# EAGLE design RFID_Eval_13.56MHz (EAGLE 5.11)
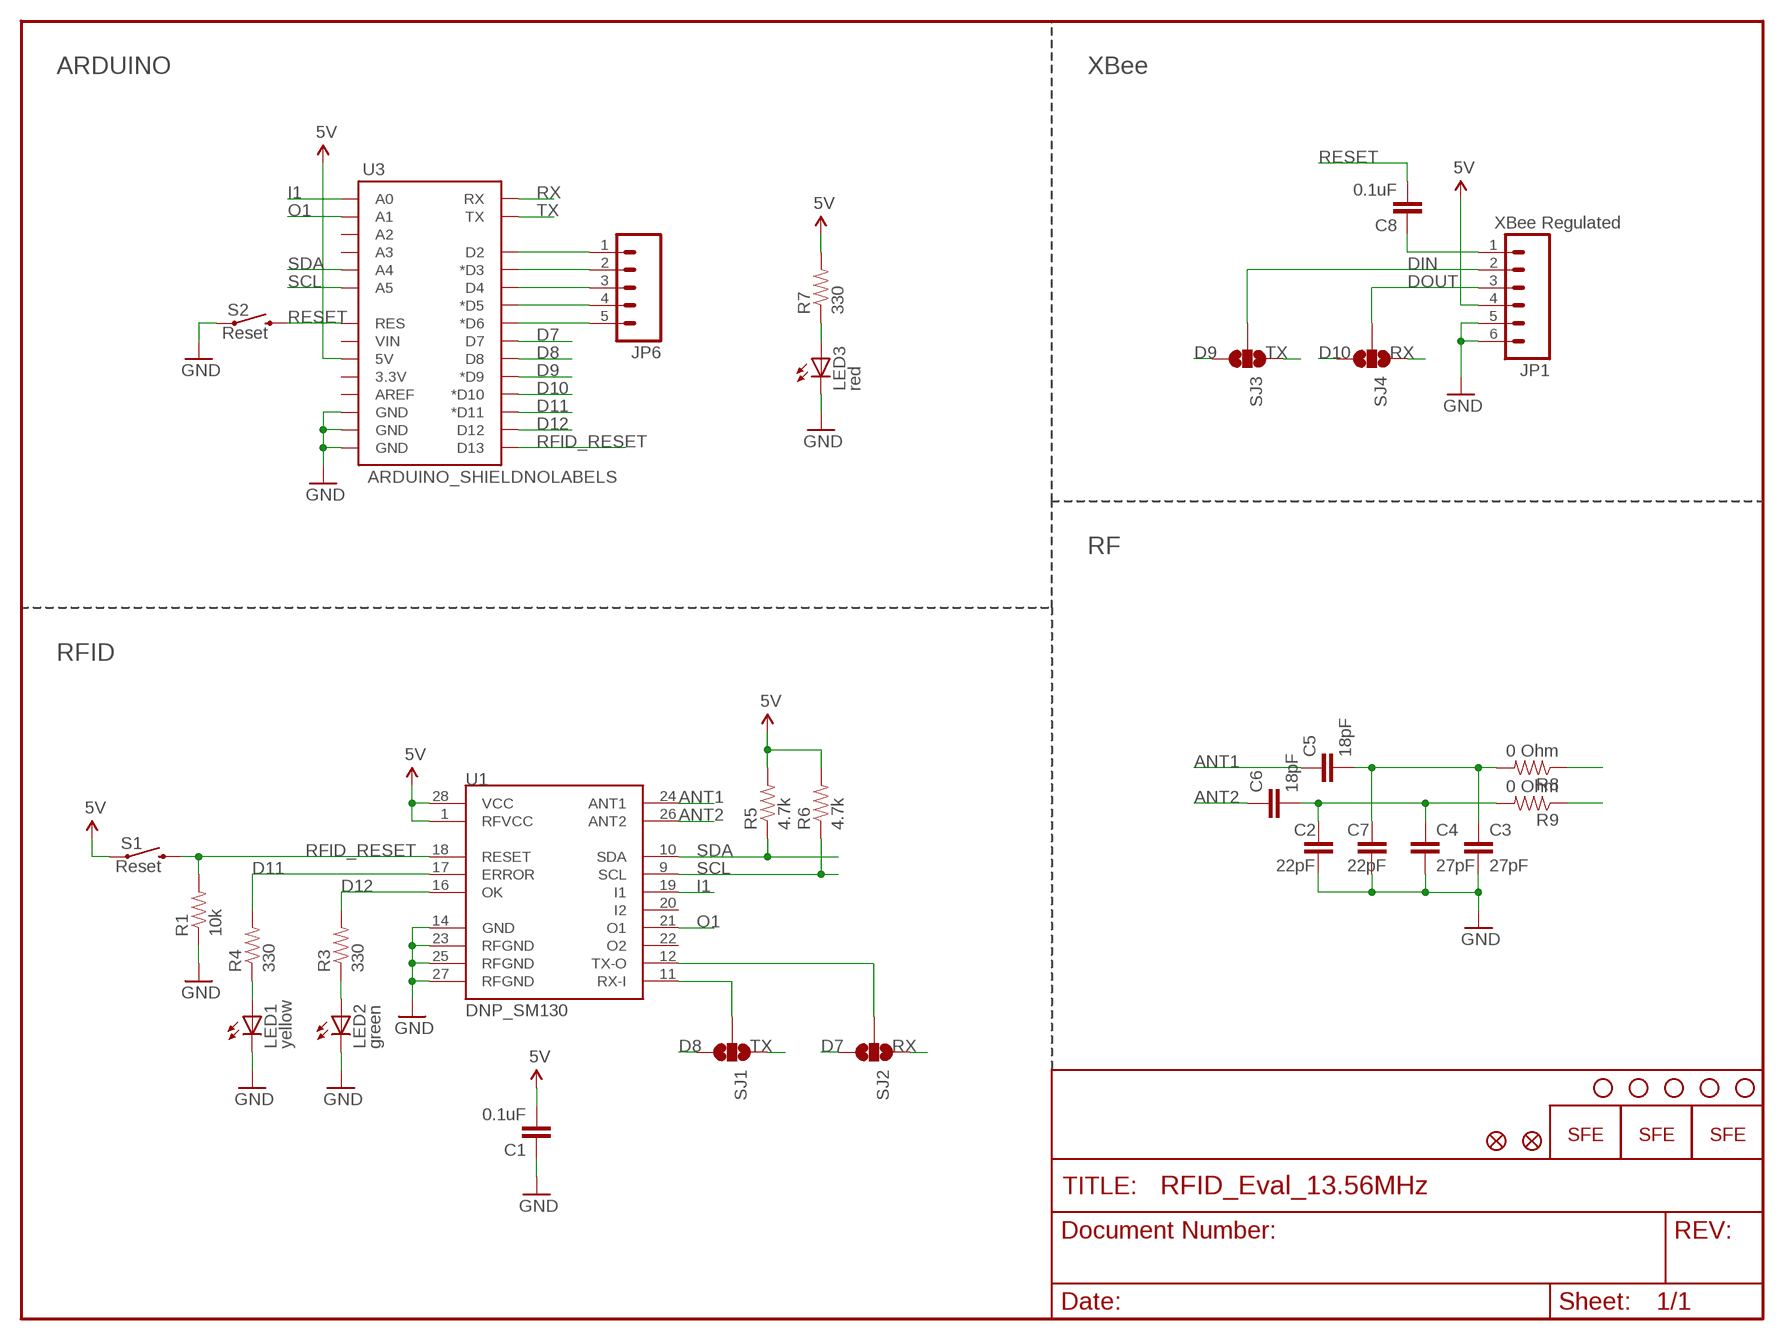
[diagram p0: schematic, sheet 1]

## Parts
C1  0.1uF  CAP0402-CAP  [0402-CAP]
C2  22pF  CAP0402-CAP  [0402-CAP]
C3  27pF  CAP0402-CAP  [0402-CAP]
C4  27pF  CAP0402-CAP  [0402-CAP]
C5  18pF  CAP0402-CAP  [0402-CAP]
C6  18pF  CAP0402-CAP  [0402-CAP]
C7  22pF  CAP0402-CAP  [0402-CAP]
C8  0.1uF  CAP0402-CAP  [0402-CAP]
JP1  XBee Regulated  M06SIP  [1X06]
JP2  LOGO-SFENEW  [SFE-NEW-WEBLOGO]
JP3  STAND-OFF  [STAND-OFF]
JP4  LOGO-SFESK  [SFE-LOGO-FLAME]
JP5  STAND-OFF  [STAND-OFF]
JP6  M05PTH  [1X05]
JP7  STAND-OFF  [STAND-OFF]
JP8  LOGO-SFENEW  [SFE-NEW-WEBLOGO]
JP10  STAND-OFF  [STAND-OFF]
JP11  FIDUCIAL1X2  [FIDUCIAL-1X2]
JP12  FIDUCIAL1X2  [FIDUCIAL-1X2]
JP13  STAND-OFF  [STAND-OFF]
LED1  yellow  LED0603  [LED-0603]
LED2  green  LED0603  [LED-0603]
LED3  red  LED0603  [LED-0603]
R1  10k  RESISTOR0402-RES  [0402-RES]
R3  330  RESISTOR0402-RES  [0402-RES]
R4  330  RESISTOR0402-RES  [0402-RES]
R5  4.7k  RESISTOR0402-RES  [0402-RES]
R6  4.7k  RESISTOR0402-RES  [0402-RES]
R7  330  RESISTOR0402-RES  [0402-RES]
R8  0 Ohm  RESISTOR0402-RES  [0402-RES]
R9  0 Ohm  RESISTOR0402-RES  [0402-RES]
S1  Reset  SWITCH-MOMENTARY-2SMD  [TACTILE_SWITCH_SMD]
S2  Reset  SWITCH-MOMENTARY-2SMD  [TACTILE_SWITCH_SMD]
SJ1  SOLDERJUMPER_2WAYPASTE2&3  [SJ_3_PASTE2&3]
SJ2  SOLDERJUMPER_2WAYPASTE2&3  [SJ_3_PASTE2&3]
SJ3  SOLDERJUMPER_2WAYPASTE2&3  [SJ_3_PASTE2&3]
SJ4  SOLDERJUMPER_2WAYPASTE2&3  [SJ_3_PASTE2&3]
U1  DNP_SM130  SM130  [SM130]
U3  ARDUINO_SHIELDNOLABELS  [DUEMILANOVE_SHIELD_NOLABELS]

## Nets
5V: C1.2 JP1.4 R5.2 R6.2 R7.2 S1.1 U1.1(RFVCC) U1.28(VCC) U3.5V
ANT1: C5.1 U1.24(ANT1)
ANT2: C6.1 U1.26(ANT2)
D7: SJ2.3 U3.D7
D8: SJ1.3 U3.D8
D9: SJ3.3 U3.D9(*D9)
D10: SJ4.3 U3.D10(*D10)
D11: R4.2 U1.17(ERROR) U3.D11(*D11)
D12: R3.2 U1.16(OK) U3.D12
DIN: JP1.2 SJ3.2
DOUT: JP1.3 SJ4.2
GND: C1.1 C2.2 C3.2 C4.2 C7.2 JP1.5 JP1.6 LED1.C LED2.C LED3.C R1.1 S2.1 U1.14(GND) U1.23(RFGND) U1.25(RFGND) U1.27(RFGND) U3.GND@0(GND) U3.GND@1(GND) U3.GND@2(GND)
I1: U1.19(I1) U3.A0
N$1: LED1.A R4.1
N$2: LED2.A R3.1
N$7: LED3.A R7.1
N$8: R8.1
N$9: R9.1
N$10: C3.1 C5.2 C7.1 R8.2
N$11: C2.1 C4.1 C6.2 R9.2
N$15: SJ2.2 U1.12(TX-O)
N$16: SJ1.2 U1.11(RX-I)
N$61: C8.1 JP1.1
N$62: JP6.1 U3.D2
N$63: JP6.2 U3.D3(*D3)
N$64: JP6.3 U3.D4
N$65: JP6.4 U3.D5(*D5)
N$66: JP6.5 U3.D6(*D6)
O1: U1.21(O1) U3.A1
RESET: C8.2 S2.3 U3.RES
RFID_RESET: R1.2 S1.3 U1.18(RESET) U3.D13
RX: SJ2.1 SJ4.1 U3.RX
SCL: R6.1 U1.9(SCL) U3.A5
SDA: R5.1 U1.10(SDA) U3.A4
TX: SJ1.1 SJ3.1 U3.TX
Unconnected: U1.20(I2) U1.22(O2) U3.3.3V U3.A2 U3.A3 U3.AREF U3.VIN

## Notes on the sheet
- ARDUINO | XBee
- RF
- RFID

## Library data of the parts
C1-C8 = SparkFun:CAP: Capacitor Standard 0603 ceramic capacitor, and 0.1" leaded capacitor.
JP1 = SparkFun:M06: Header 6 Standard 6-pin 0.1" header. Use with straight break away headers (SKU : PRT-00116), right angle break away headers (PRT-00553), swiss pins (PRT-00743), machine pins (PRT-00117), and female headers (PRT-00115). Molex polarized connector foot print use with SKU : PRT-08094 with associated crimp pins and housings. NOTES ON THE VARIANTS LOCK and LOCK_LONGPADS... This footprint was designed to help hold the alignment of a through-hole component (i.e. 6-pin header) while soldering it into place. You may notice that each hole has been shifted either up or down by 0.005 of an inch from it's more standard position (which is a perfectly straight line). This slight alteration caused the pins (the squares in the middle) to touch the edges of the holes. Because they are alternating, it causes a "brace" to hold the component in place. 0.005 has proven to be the perfect amount of "off-center" position when using our standard breakaway headers. Although looks a little odd when you look at the bare footprint, once you have a header in there, the alteration is very hard to notice. Also, if you push a header all the way into place, it is covered up entirely on the bottom side. This idea of altering the position of holes to aid alignment will be further integrated into the Sparkfun Library for other footprints. It can help hold any component with 3 or more connection pins.
JP2 JP4 JP8 = SparkFun:LOGO-SFE: Spark Fun Electronics PCB Logo This is the standard Spark Fun Electronics PCB logo.
JP3 JP5 JP7 JP10 JP13 = SparkFun:STAND-OFF: Stand Off This is the mechanical footprint for a #4 phillips button head screw. Use the keepout ring to avoid running the screw head into surrounding components. SKU : PRT-00447
JP6 = SparkFun:M05: Header 5 Standard 5-pin 0.1" header. Use with straight break away headers (SKU : PRT-00116), right angle break away headers (PRT-00553), swiss pins (PRT-00743), machine pins (PRT-00117), and female headers (PRT-00115). Molex polarized connector foot print use with SKU : PRT-08230 with associated crimp pins and housings.
JP11 JP12 = SparkFun:FIDUCIAL: Fiducial Alignment Points Various fiducial points for machine vision alignment.
LED1-LED3 = SparkFun:LED: LEDs Standard schematic elements and footprints for 5mm, 3mm, 1206, and 0603 sized LEDs. 5mm - Spark Fun Electronics SKU : COM-00529 (and others)
R1 R3-R9 = SparkFun:RESISTOR: Resistor Basic schematic elements and footprints for 0603, 1206, and PTH resistors.
S1 S2 = SparkFun:SWITCH-MOMENTARY-2
SJ1-SJ4 = SparkFun:SOLDERJUMPER_2WAY: Solder Jumper 2 way solder jumper
U1 = SparkFun:SM130: 13.56MHz RFID Mifare Read/Write Module
U3 = SparkFun:ARDUINO_SHIELD

## Board
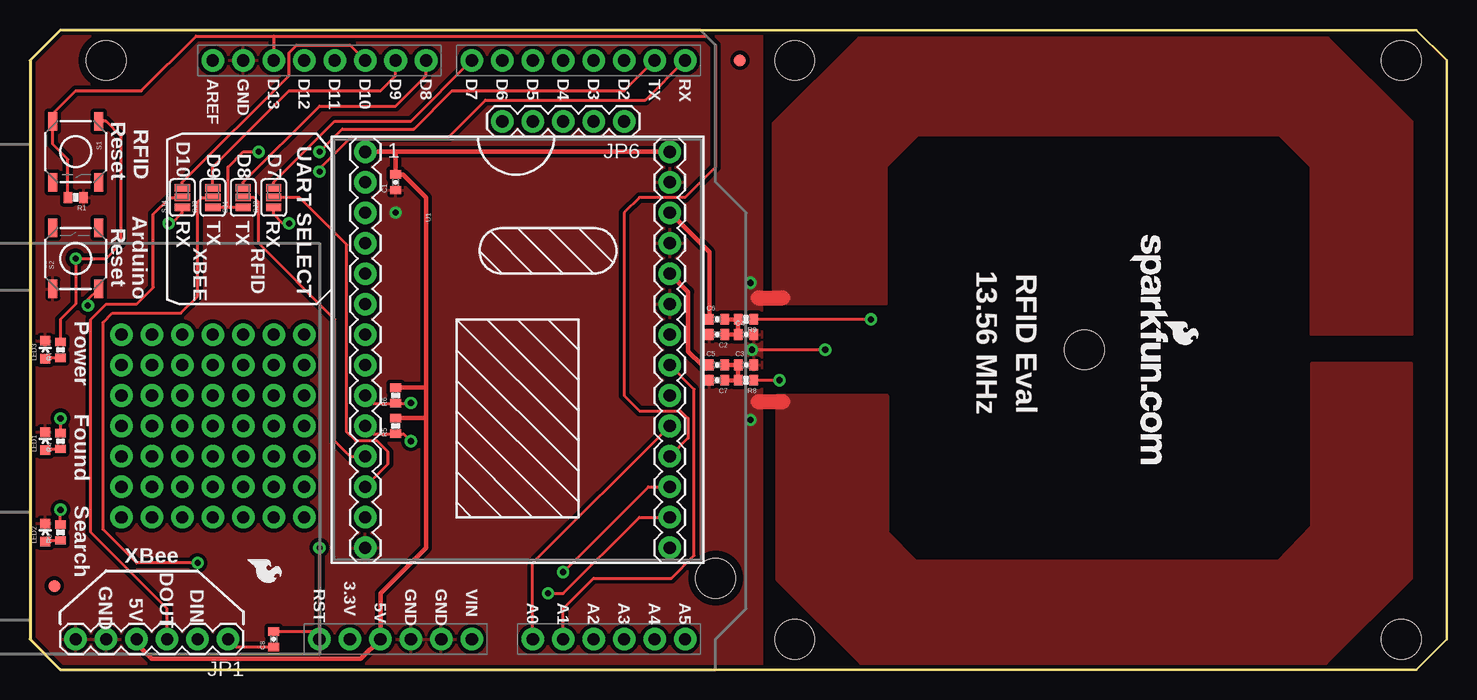
[diagram p1: board, top side]
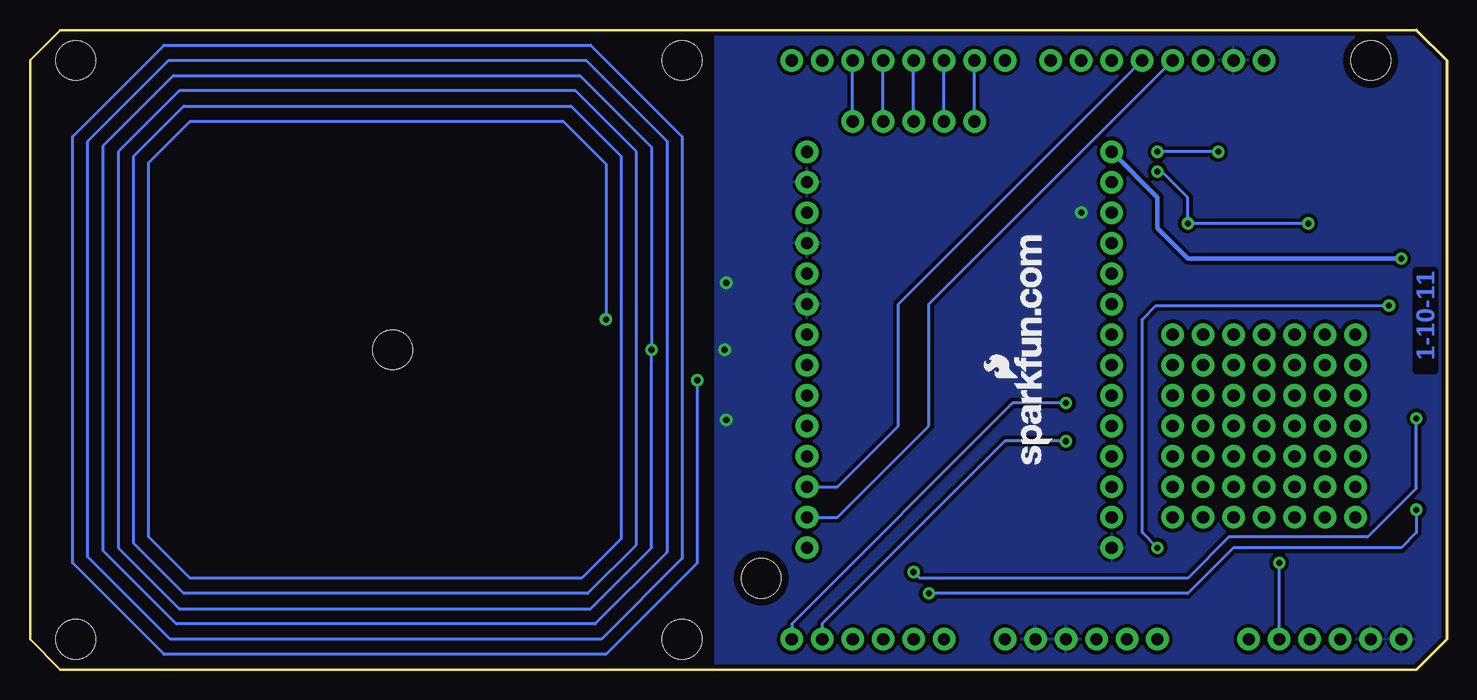
[diagram p2: board, bottom side, seen from below]

Size 118.11 x 53.34 mm. Coordinates in mm from the lower left corner, seen from the top.
Outline: 0,50.8 0,2.54 2.54,0 115.57,0 118.11,2.54 118.11,50.8 115.57,53.34 2.54,53.34 0,50.8
Copper layers (1*16): Top 0.035mm / dielectric 1.5mm / Bottom 0.035mm
Design rules "SparkFun": minimum track width 8mil, minimum drill 20mil, track to track 8mil, track to pad 8mil, pad to pad 8mil, via to via 8mil, smd to smd 8mil, copper to edge 8mil, drill to drill 8mil, minimum pad ring 12mil, minimum via ring 10mil, stop-mask expansion 4mil, vias tented up to drill 20mil, thermal gap 10mil

### Footprints (pad centres in the part's own frame; a part is rotated, then mirrored left to right if it is on the bottom)
0402-CAP = smd 0.7 x 0.9: 1 -0.65,0; 2 0.65,0
1X06 = drill 1.016 pad 1.88 round: 1 0,0; 2 2.54,0; 3 5.08,0; 4 7.62,0; 5 10.16,0; 6 12.7,0
STAND-OFF = hole 3.302: 0,0
1X05 = drill 1.016 pad 1.88 round: 1 0,0; 2 2.54,0; 3 5.08,0; 4 7.62,0; 5 10.16,0
FIDUCIAL-1X2 = smd 1 x 1: 1 0,0
LED-0603 = smd 0.8 x 0.8: A 0,-0.75; C 0,0.75
0402-RES = smd 0.7 x 0.9: 1 -0.65,0; 2 0.65,0
TACTILE_SWITCH_SMD = smd 1.524 x 0.762: 1 -2.54,1.905; 2 2.54,1.905; 3 -2.54,-1.905; 4 2.54,-1.905
SJ_3_PASTE2&3 = smd 0.635 x 1.27: 1 -0.813,0; 2 0,0; 3 0.813,0
SM130 = drill 1.016 pad 1.88 round: 1 -17.78,-12.7; 2 -15.24,-12.7; 3 -12.7,-12.7; 4 -10.16,-12.7; 5 -7.62,-12.7; 6 -5.08,-12.7; 7 -2.54,-12.7; 8 0,-12.7; 9 2.54,-12.7; 10 5.08,-12.7; 11 7.62,-12.7; 12 10.16,-12.7; 13 12.7,-12.7; 14 15.24,-12.7; 15 15.24,12.7; 16 12.7,12.7; 17 10.16,12.7; 18 7.62,12.7; 19 5.08,12.7; 20 2.54,12.7; 21 0,12.7; 22 -2.54,12.7; 23 -5.08,12.7; 24 -7.62,12.7; 25 -10.16,12.7; 26 -12.7,12.7; 27 -15.24,12.7; 28 -17.78,12.7
DUEMILANOVE_SHIELD_NOLABELS = drill 1.016 pad 1.88 round: 3.3V 50.8,26.67; 5V 50.8,29.21; A0 50.8,41.91; A1 50.8,44.45; A2 50.8,46.99; A3 50.8,49.53; A4 50.8,52.07; A5 50.8,54.61; AREF 2.54,15.24; D2 2.54,49.53; D3 2.54,46.99; D4 2.54,44.45; D5 2.54,41.91; D6 2.54,39.37; D7 2.54,36.83; D8 2.54,33.02; D9 2.54,30.48; D10 2.54,27.94; D11 2.54,25.4; D12 2.54,22.86; D13 2.54,20.32; GND@0 50.8,31.75; GND@1 50.8,34.29; GND@2 2.54,17.78; RES 50.8,24.13; RX 2.54,54.61; TX 2.54,52.07; VIN 50.8,36.83 | hole 3.302: 45.72,57.15; 2.54,6.35

### Placement (x,y rotation side)
C1  30.48,40.64 90 top
C2  57.28,27.94 180 top
C3  59.69,25.4 0 top
C4  59.69,27.94 0 top
C5  57.28,25.4 0 top
C6  57.28,29.21 0 top
C7  57.28,24.13 180 top
C8  20.32,2.54 90 top
JP1  16.51,2.54 180 top
JP2  32.89,17.14 90 bottom
JP3  87.88,26.67 0 top
JP4  18.16,9.14 270 top
JP5  114.3,50.8 0 top
JP6  49.53,45.72 180 top
JP7  114.3,2.54 0 top
JP8  91.69,36.2 270 top
JP10  63.75,50.8 0 top
JP11  2.03,6.99 0 top
JP12  59.18,50.8 0 top
JP13  63.75,2.54 0 top
LED1  1.27,19.05 0 top
LED2  1.27,11.43 0 top
LED3  1.27,26.67 0 top
R1  3.81,39.37 180 top
R3  2.54,11.43 90 top
R4  2.54,19.05 90 top
R5  30.48,20.32 90 top
R6  30.48,22.86 90 top
R7  2.54,26.67 90 top
R8  59.69,24.13 180 top
R9  59.69,29.21 180 top
S1  3.81,43.18 270 top
S2  3.81,34.29 90 top
SJ1  17.78,39.37 90 top
SJ2  20.32,39.37 90 top
SJ3  15.24,39.37 90 top
SJ4  12.7,39.37 90 top
U1  40.64,25.4 270 top
U3  0,53.34 270 top

### Tracks (layer width: path | path; a pad name or v marks a point on that pad's centre or on a via)
5V  (via drill 0.51)
  Top 0.254: S1.1 6.35,45.72 7.62,44.45 7.62,35.56 6.35,34.29 v3.81,34.29 3.81,30.48 2.54,29.21 R7.2
  Top 0.356: JP1.4 8.89,2.16 10.16,0.89 27.56,0.89 U3.5V 29.21,6.35 33.02,10.16 33.02,20.95 | 30.48,43.18 U1.1 | 30.48,43.18 U1.28 | 30.48,43.18 C1.2 31.1,41.29 33.02,39.37 33.02,23.5 | 33.02,20.95 33.02,23.5 | R5.2 33.01,20.97 33.02,20.95 | R6.2 33.01,23.51 33.02,23.5
  Bottom 0.381: v3.81,34.29 21.59,34.29 24.13,36.83 24.13,39.37 U1.1
ANT1
  Top 0.381: U1.24 54.86,31.5 54.86,26.54 56.01,25.4 C5.1
ANT2
  Top 0.381: C6.1 56.63,34.81 U1.26
D7
  Top 0.254: SJ2.3 20.32,40.64 25.4,45.72 31.75,45.72 U3.D7
D8
  Top 0.254: U3.D8 33.02,49.53 30.48,46.99 24.13,46.99 17.78,40.64 SJ1.3
D9
  Top 0.254: U3.D9 30.48,49.53 29.21,48.26 21.59,48.26 15.24,41.91 SJ3.3
D10
  Top 0.254: SJ4.3 12.7,40.64 21.59,49.53 21.59,51.44 22.23,52.07 26.67,52.07 U3.D10
D11  (via drill 0.51)
  Top 0.254: v2.54,20.95 R4.2 | U1.17 51.56,15.24 v44.45,8.13
  Bottom 0.254: U3.D11 45.72,30.48 45.72,20.32 50.8,15.24 U1.17 | v2.54,20.95 2.54,15.11 6.6,11.05 18.16,11.05 21.59,7.62 43.94,7.62 v44.45,8.13
D12  (via drill 0.51)
  Top 0.254: R3.2 v2.54,13.34 | v43.18,6.35 44.45,6.35 50.8,12.7 U1.16
  Bottom 0.254: U3.D12 43.18,30.48 43.18,20.32 50.8,12.7 U1.16 | v2.54,13.34 2.54,11.43 3.81,10.16 17.78,10.16 21.59,6.35 v43.18,6.35
DIN  (via drill 0.51)
  Top 0.254: SJ3.2 14.35,39.37 13.97,38.99 13.97,31.11 12.57,29.72 6.86,29.72 6.1,28.96 6.1,11.68 8.89,8.89 v13.97,8.89
  Bottom 0.254: JP1.2 v13.97,8.89
DOUT
  Top 0.254: SJ4.2 11.68,39.37 10.29,37.97 10.29,31.88 8.89,30.48 6.35,30.48 5.08,29.21 5.08,11.43 11.43,5.08 JP1.3
GND  (via drill 0.51)
  Top 0.254: v66.29,26.67 v60.2,26.67 59.69,26.67 | v70.1,29.21 60.33,29.21
  Top 0.813: 60.71,22.35 60.58,22.23
  Top 1.27: 60.71,22.35 62.74,22.35 | 60.71,30.99 62.74,30.99
  Bottom 0.254: v66.29,26.67 66.29,10.16 71.37,5.08 105.66,5.08 110.74,10.16 110.74,43.18 105.66,48.26 72.64,48.26 67.56,43.18 67.56,10.41 71.63,6.35 105.28,6.35 109.47,10.54 109.47,42.8 105.28,46.99 73.03,46.99 68.83,42.8 68.83,10.92 72.14,7.62 104.78,7.62 108.2,11.05 108.2,42.29 104.78,45.72 73.66,45.72 70.1,42.16 v70.1,29.21
  other vias: 60.07,32.26 60.07,20.83 30.48,38.1
  pour Bottom (isolate 0.305): 0,53.34 60.96,53.34 60.96,0 0,0
  pour Top (isolate 0.305): 0,53.34 60.96,53.34 60.96,0 0,0
  pour Top (isolate 0.305): 61.98,30.48 61.98,45.59 69.09,52.7 108.2,52.7 115.19,45.72 115.19,27.94 106.81,27.94 106.81,41.91 104.14,44.58 74.04,44.58 71.37,41.91 71.37,30.48
  pour Top (isolate 0.305): 106.81,25.53 106.81,11.94 104.01,9.02 73.91,9.02 71.5,11.43 71.5,22.86 62.23,22.86 62.23,7.49 69.22,0.51 108.08,0.51 115.19,7.62 115.19,25.53
I1
  Top 0.254: U3.A0 41.91,8.89 U1.19
N$1
  Top 0.254: R4.1 1.37,18.4 LED1.A
N$2
  Top 0.254: R3.1 1.37,10.78 LED2.A
N$3  (via drill 1.02 pad 1.88)
  other vias: 7.62,27.94
N$4  (via drill 1.02 pad 1.88)
  other vias: 7.62,25.4
N$5  (via drill 1.02 pad 1.88)
  other vias: 7.62,22.86
N$6  (via drill 1.02 pad 1.88)
  other vias: 7.62,20.32
N$7
  Top 0.254: R7.1 1.37,26.02 LED3.A
N$8  (via drill 0.51)
  Top 0.254: v62.48,24.13 R8.1
  Bottom 0.254: v62.48,24.13 62.48,8.89 70.1,1.27 106.93,1.27 114.55,8.89 114.55,44.45 106.93,52.07 71.37,52.07 63.75,44.45 63.75,9.27 70.48,2.54 106.43,2.54 113.28,9.4 113.28,44.07 106.55,50.8 71.75,50.8 65.02,44.07 65.02,9.78 70.99,3.81 105.92,3.81 112.01,9.91 112.01,43.69 106.17,49.53 72.26,49.53 66.29,43.56 66.29,26.67
N$10
  Top 0.381: C5.2 C3.1 R8.2 C7.1
N$11
  Top 0.381: C6.2 R9.2 C4.1 C2.1
N$12  (via drill 1.02 pad 1.88)
  other vias: 7.62,17.78
N$15
  Top 0.254: SJ2.2 22.48,39.37 26.42,35.43 26.42,19.81 27.18,19.05 28.96,19.05 29.84,18.16 29.84,17.14 U1.12
N$16
  Top 0.254: SJ1.2 18.67,39.37 19.05,38.99 19.05,35.56 25.4,29.21 25.4,19.05 26.67,17.78 U1.11
N$17  (via drill 1.02 pad 1.88)
  other vias: 7.62,15.24
N$18  (via drill 1.02 pad 1.88)
  other vias: 7.62,12.7
N$19  (via drill 1.02 pad 1.88)
  other vias: 10.16,12.7
N$20  (via drill 1.02 pad 1.88)
  other vias: 10.16,15.24
N$21  (via drill 1.02 pad 1.88)
  other vias: 10.16,17.78
N$22  (via drill 1.02 pad 1.88)
  other vias: 10.16,20.32
N$23  (via drill 1.02 pad 1.88)
  other vias: 10.16,22.86
N$24  (via drill 1.02 pad 1.88)
  other vias: 10.16,25.4
N$25  (via drill 1.02 pad 1.88)
  other vias: 10.16,27.94
N$26  (via drill 1.02 pad 1.88)
  other vias: 12.7,27.94
N$27  (via drill 1.02 pad 1.88)
  other vias: 12.7,25.4
N$28  (via drill 1.02 pad 1.88)
  other vias: 12.7,22.86
N$29  (via drill 1.02 pad 1.88)
  other vias: 12.7,20.32
N$30  (via drill 1.02 pad 1.88)
  other vias: 12.7,17.78
N$31  (via drill 1.02 pad 1.88)
  other vias: 12.7,15.24
N$32  (via drill 1.02 pad 1.88)
  other vias: 12.7,12.7
N$33  (via drill 1.02 pad 1.88)
  other vias: 15.24,12.7
N$34  (via drill 1.02 pad 1.88)
  other vias: 15.24,15.24
N$35  (via drill 1.02 pad 1.88)
  other vias: 15.24,17.78
N$36  (via drill 1.02 pad 1.88)
  other vias: 15.24,20.32
N$37  (via drill 1.02 pad 1.88)
  other vias: 15.24,22.86
N$38  (via drill 1.02 pad 1.88)
  other vias: 15.24,25.4
N$39  (via drill 1.02 pad 1.88)
  other vias: 15.24,27.94
N$40  (via drill 1.02 pad 1.88)
  other vias: 17.78,27.94
N$41  (via drill 1.02 pad 1.88)
  other vias: 17.78,25.4
N$42  (via drill 1.02 pad 1.88)
  other vias: 17.78,22.86
N$43  (via drill 1.02 pad 1.88)
  other vias: 17.78,20.32
N$44  (via drill 1.02 pad 1.88)
  other vias: 17.78,17.78
N$45  (via drill 1.02 pad 1.88)
  other vias: 17.78,15.24
N$46  (via drill 1.02 pad 1.88)
  other vias: 17.78,12.7
N$47  (via drill 1.02 pad 1.88)
  other vias: 20.32,12.7
N$48  (via drill 1.02 pad 1.88)
  other vias: 20.32,15.24
N$49  (via drill 1.02 pad 1.88)
  other vias: 20.32,17.78
N$50  (via drill 1.02 pad 1.88)
  other vias: 20.32,20.32
N$51  (via drill 1.02 pad 1.88)
  other vias: 20.32,22.86
N$52  (via drill 1.02 pad 1.88)
  other vias: 20.32,25.4
N$53  (via drill 1.02 pad 1.88)
  other vias: 20.32,27.94
N$54  (via drill 1.02 pad 1.88)
  other vias: 22.86,27.94
N$55  (via drill 1.02 pad 1.88)
  other vias: 22.86,25.4
N$56  (via drill 1.02 pad 1.88)
  other vias: 22.86,22.86
N$57  (via drill 1.02 pad 1.88)
  other vias: 22.86,20.32
N$58  (via drill 1.02 pad 1.88)
  other vias: 22.86,17.78
N$59  (via drill 1.02 pad 1.88)
  other vias: 22.86,15.24
N$60  (via drill 1.02 pad 1.88)
  other vias: 22.86,12.7
N$61
  Top 0.254: C8.1 17.16,1.89 JP1.1
N$62
  Bottom 0.254: JP6.1 U3.D2
N$63
  Bottom 0.254: JP6.2 U3.D3
N$64
  Bottom 0.254: JP6.3 U3.D4
N$65
  Bottom 0.254: JP6.4 U3.D5
N$66
  Bottom 0.254: JP6.5 U3.D6
O1
  Top 0.254: U3.A1 44.45,5.08 46.99,7.62 53.47,7.62 55.37,9.53 55.37,23.37 U1.21
RESET  (via drill 0.51)
  Top 0.254: C8.2 23.48,3.19 U3.RES v24.13,10.16 | v4.83,30.35 4.83,30.86 S2.3
  Bottom 0.254: v24.13,10.16 25.4,11.43 25.4,29.21 24.26,30.35 v4.83,30.35
RFID_RESET
  Top 0.254: R1.2 3.16,42.56 1.91,43.81 S1.3 1.91,46.35 3.81,48.26 9.27,48.26 13.84,52.83 20.32,52.83 | 20.32,52.83 56.39,52.83 57.15,52.07 57.15,41.91 54.61,39.37 50.8,39.37 49.53,38.1 49.53,22.86 50.8,21.59 54.23,21.59 54.86,20.95 54.86,19.3 U1.18 | 20.32,52.83 U3.D13
RX  (via drill 0.51)
  Top 0.254: v11.56,37.21 11.81,37.21 12.7,38.1 SJ4.1 | SJ2.1 20.32,37.97 21.08,37.21 v21.59,37.21 | v24.13,41.53 24.13,41.78 26.8,44.45 34.92,44.45 37.97,47.5 51.31,47.5 U3.RX
  Bottom 0.254: v11.56,37.21 v21.59,37.21 21.59,39.37 23.75,41.53 v24.13,41.53
SCL  (via drill 0.51)
  Top 0.254: U1.9 28.59,22.21 R6.1 31.73,22.21 v31.75,22.23
  Bottom 0.254: v31.75,22.23 36.2,22.23 54.61,3.81 U3.A5
SDA  (via drill 0.51)
  Top 0.254: U1.10 28.59,19.67 R5.1 31.13,19.67 v31.75,19.05
  Bottom 0.254: U3.A4 52.07,3.81 36.83,19.05 v31.75,19.05
TX  (via drill 0.51)
  Top 0.254: SJ3.1 16.51,38.56 | 16.51,38.56 SJ1.1 | U3.TX 49.53,48.26 35.18,48.26 32,45.09 26.04,45.09 v24.13,43.18 | v19.05,43.18 17.78,43.18 16.51,41.91 16.51,38.56
  Bottom 0.254: v19.05,43.18 v24.13,43.18

### Text on the board
Bottom: 1-10-11
tPlace: AREF | GND | D13 | D12 | D11 | D10 | D9 | D8 | D7 | D6 | D5 | D4 | D3 | D2 | TX | RX | Reset | RFID | D10 | UART SELECT | D9 | D8 | D7 | Arduino | Reset | RX | TX | TX | RX | XBEE | RFID | 13.56 MHz | RFID Eval | Power | Found | Search | XBee | DOUT | GND | DIN | RST | 3.3V | GND | GND | VIN | 5V | 5V | A0 | A1 | A2 | A3 | A4 | A5